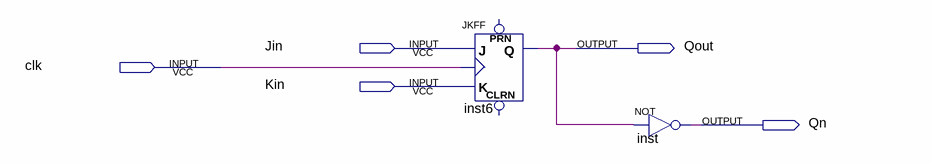
[diagram p0: schematic sheet]
// Quartus schematic bloque.bdf as structural Verilog: 2 symbols, 5 pins
module bloque (
  input  Jin,
  input  clk,
  input  Kin,
  output Qout,
  output Qn
);

  JKFF inst6 (.K(Kin), .J(Jin), .CLK(clk), .Q(Qout));  // open: PRN, CLRN
  not inst (Qn, Qout);
endmodule
